# Altium schematic sheet 1_P1.schdoc
size 391 x 645 mm; Symbol: Drawing-Symbol_A4; Device: Drawing-Symbol_A4; @Project Name: Ai-Camera; @Page Count: 1; @Update Date: 2025-11-25; @Create Date: 2025-08-22; @Schematic Name: Schematic1; @Page No: 1; @Page Name: P1; Company: EasyEDA.com; Version: V1.0; Page Size: A4; @Create Time: 04:24:12; @Update Time: 13:54:11; Width: 1500; Height: 2500; Region Start: 1; X Region Count: 6; Y Region Count: 4; Blade Width: 10; Title Block Position: 3; @Board Name: Board1
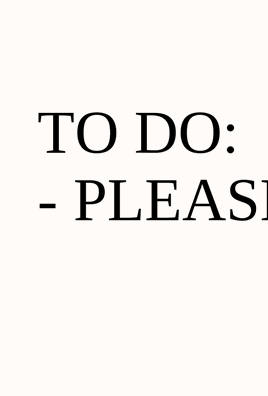
[diagram p0: 1_P1.schdoc, top left]
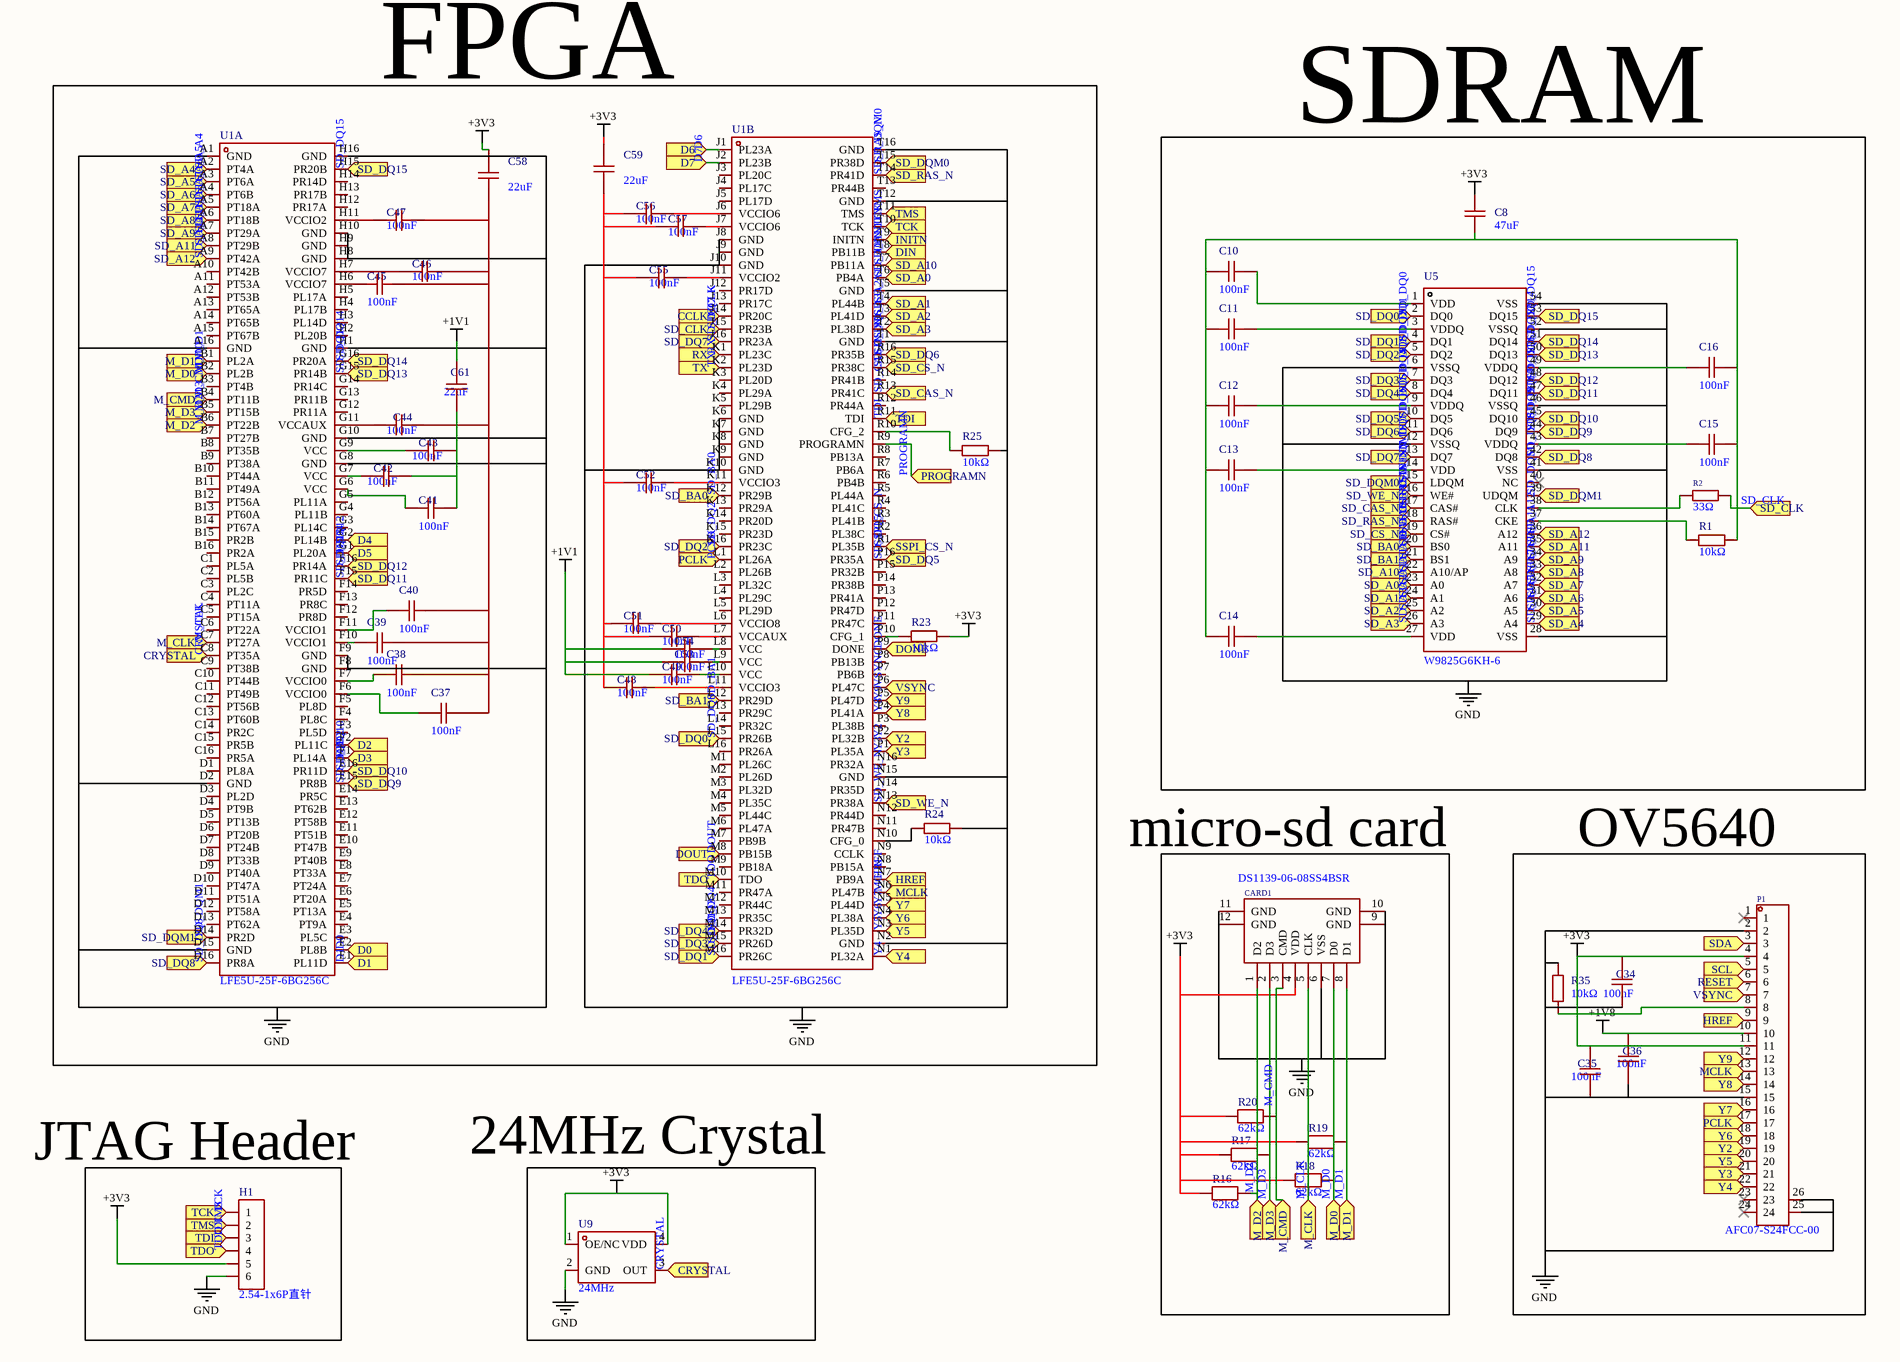
[diagram p1: 1_P1.schdoc, top right]
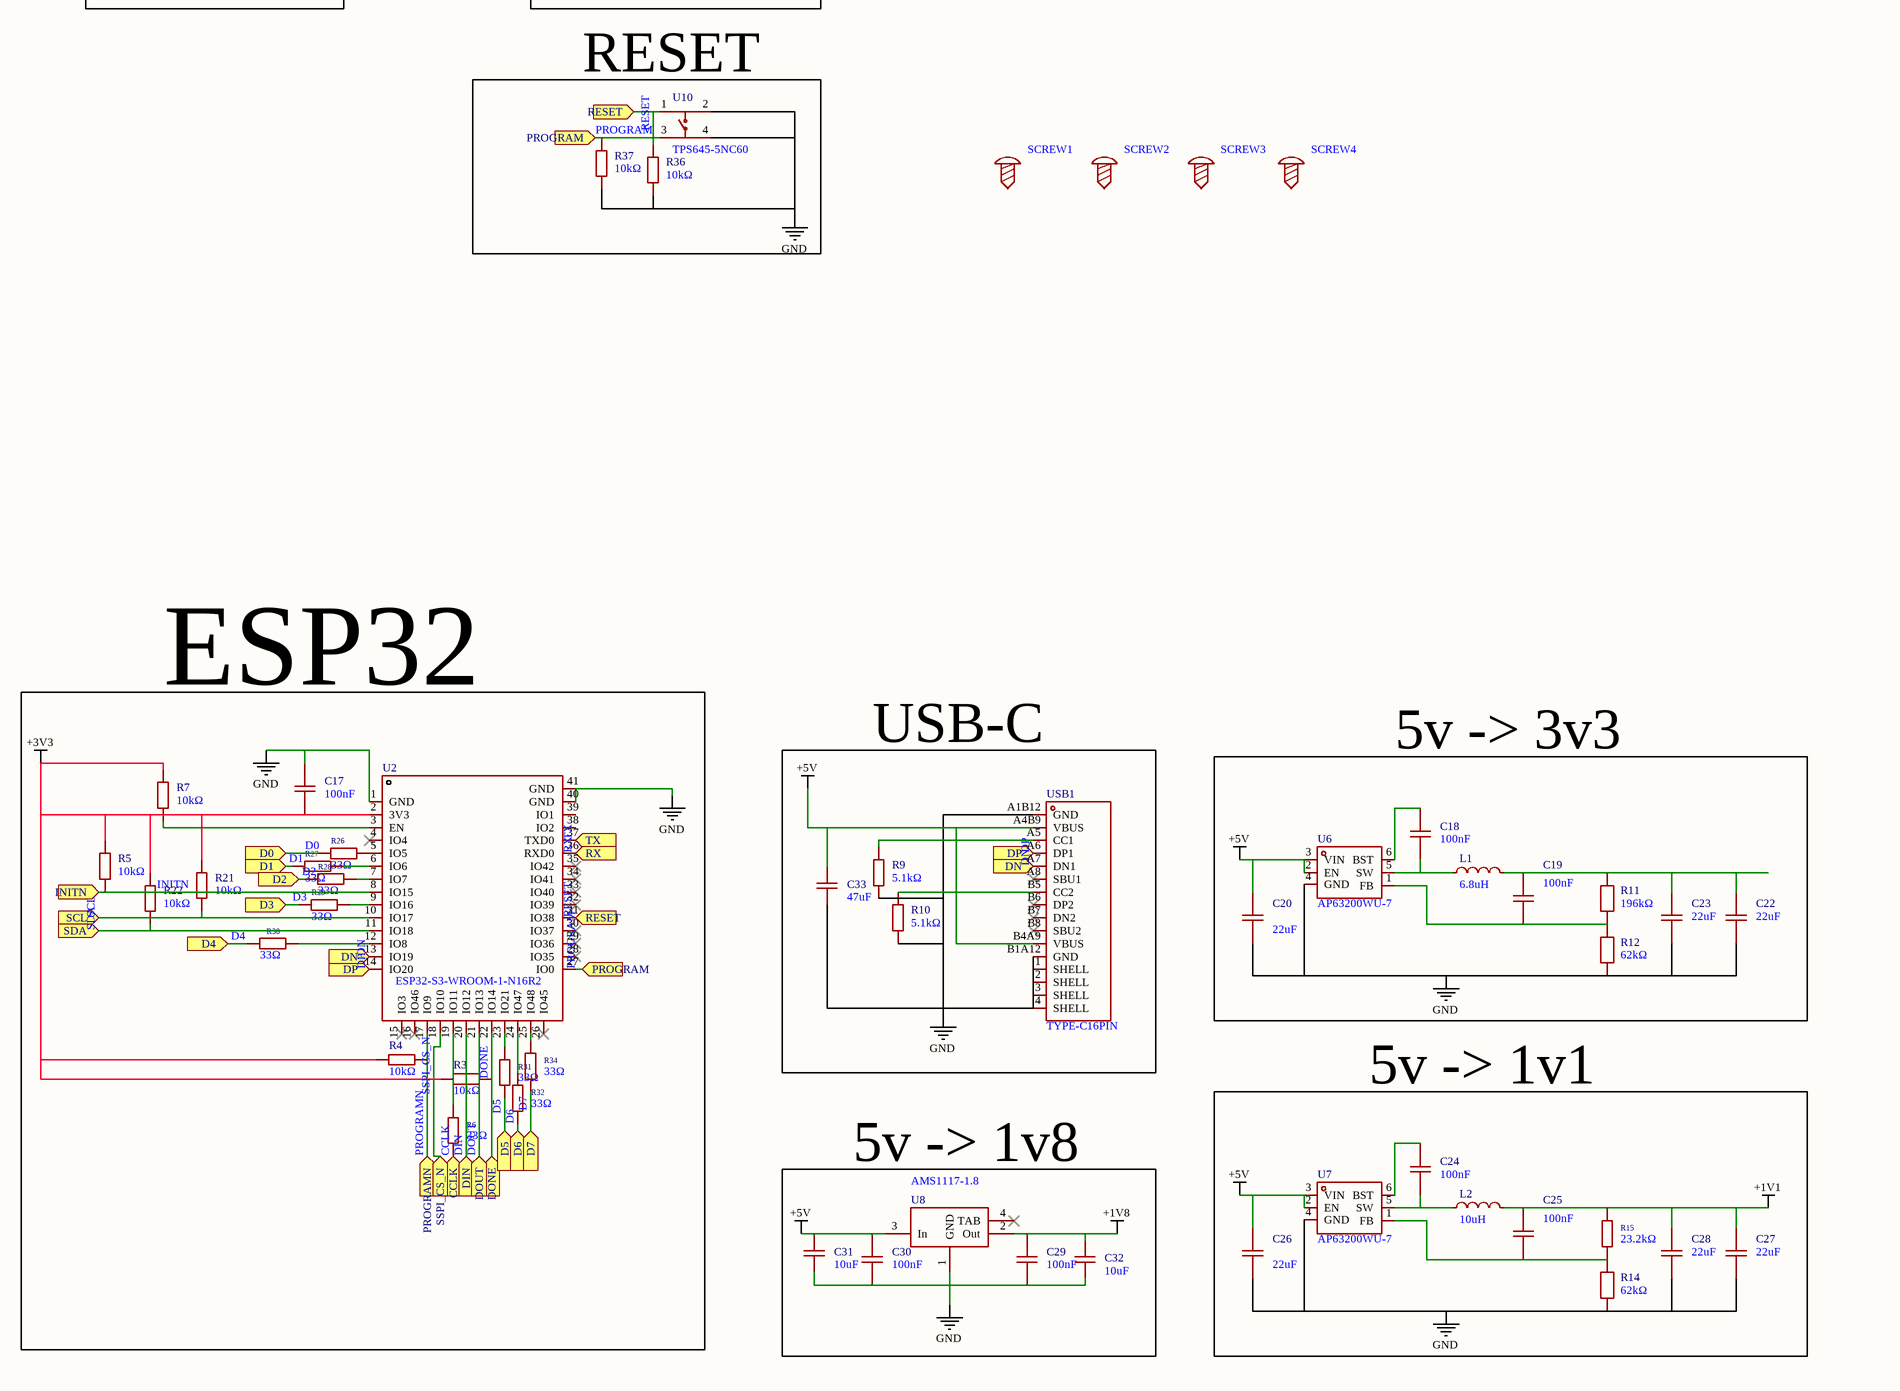
[diagram p2: 1_P1.schdoc, bottom right]

## Parts
C8  47uF  [C0805]
C10  100nF  [C01005]
C11  100nF  [C01005]
C12  100nF  [C01005]
C13  100nF  [C01005]
C14  100nF  [C01005]
C15  100nF  [C01005]
C16  100nF  [C01005]
C17  100nF  [C01005]
C18  100nF  [C01005]
C19  100nF  [C0603]
C20  22uF  [C0603]
C22  22uF  [C0603]
C23  22uF  [C0603]
C24  100nF  [C01005]
C25  100nF  [C0603]
C26  22uF  [C0603]
C27  22uF  [C0603]
C28  22uF  [C0603]
C29  100nF  [C01005]
C30  100nF  [C01005]
C31  10uF  [C0402]
C32  10uF  [C0402]
C33  47uF  [C0805]
C34  100nF  [C01005]
C35  100nF  [C01005]
C36  100nF  [C01005]
C37  100nF  [C01005]
C38  100nF  [C01005]
C39  100nF  [C01005]
C40  100nF  [C01005]
C41  100nF  [C01005]
C42  100nF  [C01005]
C43  100nF  [C01005]
C44  100nF  [C01005]
C45  100nF  [C01005]
C46  100nF  [C01005]
C47  100nF  [C01005]
C48  100nF  [C01005]
C49  100nF  [C01005]
C50  100nF  [C01005]
C51  100nF  [C01005]
C52  100nF  [C01005]
C53  100nF  [C01005]
C54  100nF  [C01005]
C55  100nF  [C01005]
C56  100nF  [C01005]
C57  100nF  [C01005]
C58  22uF  [C0603]
C59  22uF  [C0603]
C61  22uF  [C0603]
CARD1  DS1139-06-08SS4BSR  [TF-SMD_DS1139-06-08SS4BSR]
H1  2.54-1x6P直针  [HDR-TH_6P-P2.54-V-M-1]
L1  6.8uH  [IND-SMD_L7.0-W6.6]
L2  10uH  [IND-SMD_L7.3-W6.8]
P1  AFC07-S24FCC-00  [FPC-SMD_AFC07-S24FCC-00]
R1  10kΩ  [R0402]
R2  33Ω  [R0402]
R3  10kΩ  [R0402]
R4  10kΩ  [R0402]
R5  10kΩ  [R0402]
R6  33Ω  [R0402]
R7  10kΩ  [R0402]
R9  5.1kΩ  [R0603]
R10  5.1kΩ  [R0603]
R11  196kΩ  [R0603]
R12  62kΩ  [R0603]
R14  62kΩ  [R0603]
R15  23.2kΩ  [R0603]
R16  62kΩ  [R0603]
R17  62kΩ  [R0603]
R18  62kΩ  [R0603]
R19  62kΩ  [R0603]
R20  62kΩ  [R0603]
R21  10kΩ  [R0402]
R22  10kΩ  [R0402]
R23  10kΩ  [R0402]
R24  10kΩ  [R0402]
R25  10kΩ  [R0402]
R26  33Ω  [R0402]
R27  33Ω  [R0402]
R28  33Ω  [R0402]
R29  33Ω  [R0402]
R30  33Ω  [R0402]
R31  33Ω  [R0402]
R32  33Ω  [R0402]
R34  33Ω  [R0402]
R35  10kΩ  [R0402]
R36  10kΩ  [R0402]
R37  10kΩ  [R0402]
SCREW1  (no value)  [Screw-Hole-M2]
SCREW2  (no value)  [Screw-Hole-M2]
SCREW3  (no value)  [Screw-Hole-M2]
SCREW4  (no value)  [Screw-Hole-M2]
U1  LFE5U-25F-6BG256C  [CABGA-256_L14.0-W14.0-R16-C16-P0.80-TL]  (parts A,B of 2)
U2  ESP32-S3-WROOM-1-N16R2  [WIRELM-SMD_ESP32-S3-WROOM-1]
U5  W9825G6KH-6  [TSOP-54_L22.2-W10.2-P0.80-LS11.8-BL]
U6  AP63200WU-7  [SOT-23-6_L2.9-W1.6-P0.95-LS2.8-BR]
U7  AP63200WU-7  [SOT-23-6_L2.9-W1.6-P0.95-LS2.8-BR]
U8  AMS1117-1.8  [SOT-223-4_L6.5-W3.5-P2.30-LS7.0-BR]
U9  24MHz  [OSC-SMD_4P-L3.2-W2.5-BL]
U10  TPS645-5NC60  [SW-SMD_4P-L6.0-W6.0-P4.50-LS9.2]
USB1  TYPE-C16PIN  [USB-C-SMD_TYPE-C16PIN]

## Blocks framed on the sheet
FPGA: C37-C59 C61 R23-R25 U1
SDRAM: C8 C10-C16 R1 R2 U5
OV5640: C34-C36 P1 R35
RESET: R36 R37 U10
ESP32: C17 R3-R7 R21 R22 R26-R32 R34 U2
USB-C: C33 R9 R10 USB1
5v -> 3v3: C18-C20 C22 C23 L1 R11 R12 U6
5v -> 1v1: C24-C28 L2 R14 R15 U7
5v -> 1v8: C29-C32 U8

## Ports
CCLK (in), CRYSTAL (in), D0 (in), D1 (in), D2 (in), D3 (in), D4 (in), D5 (in), D6 (in), D7 (in), DIN (in), DN (in), DONE (in), DOUT (in), DP (in), HREF (in), INITN (in), M_CLK (in), M_CMD (in), M_D0 (in), M_D1 (in), M_D2 (in), M_D3 (in), MCLK (in), PCLK (in), PROGRAM (in), PROGRAMN (in), RESET (in), RX (in), SCL (in), SD_A0 (in), SD_A1 (in), SD_A2 (in), SD_A3 (in), SD_A4 (in), SD_A5 (in), SD_A6 (in), SD_A7 (in), SD_A8 (in), SD_A9 (in), SD_A10 (in), SD_A11 (in), SD_A12 (in), SD_BA0 (in), SD_BA1 (in), SD_CAS_N (in), SD_CLK (in), SD_CS_N (in), SD_DQ0 (in), SD_DQ1 (in), SD_DQ2 (in), SD_DQ3 (in), SD_DQ4 (in), SD_DQ5 (in), SD_DQ6 (in), SD_DQ7 (in), SD_DQ8 (in), SD_DQ9 (in), SD_DQ10 (in), SD_DQ11 (in), SD_DQ12 (in), SD_DQ13 (in), SD_DQ14 (in), SD_DQ15 (in), SD_DQM0 (in), SD_DQM1 (in), SD_RAS_N (in), SD_WE_N (in), SDA (in), SSPI_CS_N (in), TCK (in), TDI (in), TDO (in), TMS (in), TX (in), VSYNC (in), Y2 (in), Y3 (in), Y4 (in), Y5 (in), Y6 (in), Y7 (in), Y8 (in), Y9 (in)

## Nets
+1V1: C25.2 C27.2 C28.2 C49.2 C53.2 C54.2 C61.2 L2.2 R15.2
+1V8: C29.1 C32.2 C36.1 P1.10 U8.2(Out)
+3V3: C8.2 C17.2 C34.1 C35.1 C58.2 C59.2 CARD1.4(VDD) H1.5 P1.4 P1.11 R3.1 R4.1 R5.2 R7.2 R16.2 R17.2 R18.2 R19.2 R20.2 R21.2 R22.2 R23.1 U2.2(3V3) U9.1(OE/NC) U9.4(VDD)
+5V: C20.2 C26.2 C30.1 C31.2 C33.2 U6.2(EN) U6.3(VIN) U7.2(EN) U7.3(VIN) U8.3(In) USB1.A4B9(VBUS) USB1.B4A9(VBUS)
GND: C17.1 C20.1 C22.1 C23.1 C26.1 C27.1 C28.1 C33.1 C34.2 C35.2 C36.2 CARD1.6(VSS) CARD1.9(GND) CARD1.10(GND) CARD1.11(GND) CARD1.12(GND) H1.6 P1.2 P1.15 P1.25 P1.26 R9.1 R10.1 R12.1 R14.1 R24.1 R25.1 R35.2 R36.2 R37.2 U1.A1(GND) U1.A16(GND) U1.D2(GND) U1.D15(GND) U1.F8(GND) U1.F9(GND) U1.G8(GND) U1.G10(GND) U1.H1(GND) U1.H8(GND) U1.H9(GND) U1.H10(GND) U1.H16(GND) U1.J8(GND) U1.J9(GND) U1.J10(GND) U1.K6(GND) U1.K7(GND) U1.K8(GND) U1.K9(GND) U1.K10(GND) U1.N2(GND) U1.N15(GND) U1.T1(GND) U1.T5(GND) U1.T12(GND) U1.T16(GND) U2.1(GND) U2.40(GND) U2.41(GND) U5.6(VSSQ) U5.12(VSSQ) U5.28(VSS) U5.41(VSS) U5.46(VSSQ) U5.52(VSSQ) U5.54(VSS) U6.4(GND) U7.4(GND) U8.1(GND) U9.2(GND) U10.2 U10.4 USB1.1(SHELL) USB1.2(SHELL) USB1.3(SHELL) USB1.4(SHELL) USB1.A1B12(GND) USB1.B1A12(GND)
CCLK: R6.1 U1.J14(PR20C) ; port CCLK
CRYSTAL: U1.C8(PT35A) U9.3(OUT) ; port CRYSTAL
D0: R26.1 U1.E2(PL8B) ; port D0
D1: R27.1 U1.E1(PL11D) ; port D1
D2: R28.1 U1.F2(PL11C) ; port D2
D3: R29.1 U1.F1(PL14A) ; port D3
D4: R30.1 U1.G2(PL14B) ; port D4
D5: R31.1 U1.G1(PL20A) ; port D5
D6: R32.1 U1.J1(PL23A) ; port D6
D7: R34.1 U1.J2(PL23B) ; port D7
DIN: U1.T8(PB11B) U2.20(IO12) ; port DIN
DN: U2.13(IO19) USB1.A7(DN1) ; port DN
DONE: R3.2 U1.P9(DONE) U2.22(IO14) ; port DONE
DOUT: U1.M8(PB15B) U2.21(IO13) ; port DOUT
DP: U2.14(IO20) USB1.A6(DP1) ; port DP
HREF: P1.9 U1.N7(PB9A) ; port HREF
INITN: R5.1 U1.T9(INITN) U2.8(IO15) ; port INITN
M_CLK: CARD1.5(CLK) U1.C7(PT27A) ; port M_CLK
M_CMD: CARD1.3(CMD) R20.1 U1.B4(PT11B) ; port M_CMD
M_D0: CARD1.7(D0) R18.1 U1.B2(PL2B) ; port M_D0
M_D1: CARD1.8(D1) R19.1 U1.B1(PL2A) ; port M_D1
M_D2: CARD1.1(D2) R16.1 U1.B6(PT22B) ; port M_D2
M_D3: CARD1.2(D3) R17.1 U1.B5(PT15B) ; port M_D3
MCLK: P1.13 U1.N6(PL47B) ; port MCLK
PCLK: P1.17 U1.L1(PL26A) ; port PCLK
PROGRAM: R37.1 U2.27(IO0) U10.3 ; port PROGRAM
PROGRAMN: R4.2 U1.R9(PROGRAMN) U2.17(IO9) ; port PROGRAMN
RESET: P1.6 R36.1 U2.31(IO38) U10.1 ; port RESET
RX: U1.K1(PL23C) U2.36(RXD0) ; port RX
SCL: P1.5 R21.1 U2.10(IO17) ; port SCL
SD_A0: U1.T6(PB4A) U5.23(A0) ; port SD_A0
SD_A1: U1.T4(PL44B) U5.24(A1) ; port SD_A1
SD_A2: U1.T3(PL41D) U5.25(A2) ; port SD_A2
SD_A3: U1.T2(PL38D) U5.26(A3) ; port SD_A3
SD_A4: U1.A2(PT4A) U5.29(A4) ; port SD_A4
SD_A5: U1.A3(PT6A) U5.30(A5) ; port SD_A5
SD_A6: U1.A4(PT6B) U5.31(A6) ; port SD_A6
SD_A7: U1.A5(PT18A) U5.32(A7) ; port SD_A7
SD_A8: U1.A6(PT18B) U5.33(A8) ; port SD_A8
SD_A9: U1.A7(PT29A) U5.34(A9) ; port SD_A9
SD_A10: U1.T7(PB11A) U5.22(A10/AP) ; port SD_A10
SD_A11: U1.A8(PT29B) U5.35(A11) ; port SD_A11
SD_A12: U1.A9(PT42A) U5.36(A12) ; port SD_A12
SD_BA0: U1.K12(PR29B) U5.20(BS0) ; port SD_BA0
SD_BA1: U1.L12(PR29D) U5.21(BS1) ; port SD_BA1
SD_CAS_N: U1.R13(PR41C) U5.17(CAS#) ; port SD_CAS_N
SD_CLK: R2.2 U1.J15(PR23B) ; port SD_CLK
SD_CS_N: U1.R15(PR38C) U5.19(CS#) ; port SD_CS_N
SD_DQ0: U1.L15(PR26B) U5.2(DQ0) ; port SD_DQ0
SD_DQ1: U1.M16(PR26C) U5.4(DQ1) ; port SD_DQ1
SD_DQ2: U1.K16(PR23C) U5.5(DQ2) ; port SD_DQ2
SD_DQ3: U1.M15(PR26D) U5.7(DQ3) ; port SD_DQ3
SD_DQ4: U1.M14(PR32D) U5.8(DQ4) ; port SD_DQ4
SD_DQ5: U1.P16(PR35A) U5.10(DQ5) ; port SD_DQ5
SD_DQ6: U1.R16(PR35B) U5.11(DQ6) ; port SD_DQ6
SD_DQ7: U1.J16(PR23A) U5.13(DQ7) ; port SD_DQ7
SD_DQ8: U1.D16(PR8A) U5.42(DQ8) ; port SD_DQ8
SD_DQ9: U1.E15(PR8B) U5.44(DQ9) ; port SD_DQ9
SD_DQ10: U1.E16(PR11D) U5.45(DQ10) ; port SD_DQ10
SD_DQ11: U1.F15(PR11C) U5.47(DQ11) ; port SD_DQ11
SD_DQ12: U1.F16(PR14A) U5.48(DQ12) ; port SD_DQ12
SD_DQ13: U1.G15(PR14B) U5.50(DQ13) ; port SD_DQ13
SD_DQ14: U1.G16(PR20A) U5.51(DQ14) ; port SD_DQ14
SD_DQ15: U1.H15(PR20B) U5.53(DQ15) ; port SD_DQ15
SD_DQM0: U1.T15(PR38D) U5.15(LDQM) ; port SD_DQM0
SD_DQM1: U1.D14(PR2D) U5.39(UDQM) ; port SD_DQM1
SD_RAS_N: U1.T14(PR41D) U5.18(RAS#) ; port SD_RAS_N
SD_WE_N: U1.N13(PR38A) U5.16(WE#) ; port SD_WE_N
SDA: P1.3 R22.1 U2.11(IO18) ; port SDA
SSPI_CS_N: U1.R1(PL35B) U2.18(IO10) ; port SSPI_CS_N
TCK: H1.1 U1.T10(TCK) ; port TCK
TDI: H1.3 U1.R11(TDI) ; port TDI
TDO: H1.4 U1.M10(TDO) ; port TDO
TMS: H1.2 U1.T11(TMS) ; port TMS
TX: U1.K2(PL23D) U2.37(TXD0) ; port TX
VSYNC: P1.7 U1.P6(PL47C) ; port VSYNC
Y2: P1.19 U1.P2(PL32B) ; port Y2
Y3: P1.21 U1.P1(PL35A) ; port Y3
Y4: P1.22 U1.N1(PL32A) ; port Y4
Y5: P1.20 U1.N3(PL35D) ; port Y5
Y6: P1.18 U1.N4(PL38A) ; port Y6
Y7: P1.16 U1.N5(PL44D) ; port Y7
Y8: P1.14 U1.P4(PL41A) ; port Y8
Y9: P1.12 U1.P5(PL47D) ; port Y9
NetC8_1: C8.1 C10.2 C11.2 C12.2 C13.2 C14.2 C15.1 C16.1 R1.2
NetC10_1: C10.1 U5.1(VDD)
NetC11_1: C11.1 U5.3(VDDQ)
NetC12_1: C12.1 U5.9(VDDQ)
NetC13_1: C13.1 U5.14(VDD)
NetC14_1: C14.1 U5.27(VDD)
NetC15_2: C15.2 U5.43(VDDQ)
NetC16_2: C16.2 U5.49(VDDQ)
NetC18_1: C18.1 U6.6(BST)
NetC18_2: C18.2 L1.1 U6.5(SW)
NetC19_1: C19.1 R11.1 R12.2 U6.1(FB)
NetC19_2: C19.2 C22.2 C23.2 L1.2 R11.2
NetC24_1: C24.1 U7.6(BST)
NetC24_2: C24.2 L2.1 U7.5(SW)
NetC25_1: C25.1 R14.2 R15.1 U7.1(FB)
NetC29_2: C29.2 C30.2 C31.1 C32.1
NetC37_1: C37.1 C38.1 C39.1 C40.1 C44.1 C45.1 C46.1 C47.1 C58.1
NetC37_2: C37.2 U1.F6(VCCIO0)
NetC38_2: C38.2 U1.F7(VCCIO0)
NetC39_2: C39.2 U1.F10(VCCIO1)
NetC40_2: C40.2 U1.F11(VCCIO1)
NetC41_1: C41.1 C42.1 C43.1 C61.1
NetC41_2: C41.2 U1.G6(VCC)
NetC42_2: C42.2 U1.G7(VCC)
NetC43_2: C43.2 U1.G9(VCC)
NetC44_2: C44.2 U1.G11(VCCAUX)
NetC45_2: C45.2 U1.H6(VCCIO7)
NetC46_2: C46.2 U1.H7(VCCIO7)
NetC47_2: C47.2 U1.H11(VCCIO2)
NetC48_1: C48.1 U1.L11(VCCIO3)
NetC48_2: C48.2 C50.2 C51.2 C52.2 C55.2 C56.2 C57.2 C59.1
NetC49_1: C49.1 U1.L10(VCC)
NetC50_1: C50.1 U1.L7(VCCAUX)
NetC51_1: C51.1 U1.L6(VCCIO8)
NetC52_1: C52.1 U1.K11(VCCIO3)
NetC53_1: C53.1 U1.L9(VCC)
NetC54_1: C54.1 U1.L8(VCC)
NetC55_1: C55.1 U1.J11(VCCIO2)
NetC56_1: C56.1 U1.J6(VCCIO6)
NetC57_1: C57.1 U1.J7(VCCIO6)
NetP1_8: P1.8 R35.1
NetR1_1: R1.1 U5.37(CKE)
NetR2_1: R2.1 U5.38(CLK)
NetR6_2: R6.2 U2.19(IO11)
NetR7_1: R7.1 U2.3(EN)
NetR9_2: R9.2 USB1.A5(CC1)
NetR10_2: R10.2 USB1.B5(CC2)
NetR23_2: R23.2 U1.P10(CFG_1)
NetR24_2: R24.2 U1.N10(CFG_0)
NetR25_2: R25.2 U1.R10(CFG_2)
NetR26_2: R26.2 U2.5(IO5)
NetR27_2: R27.2 U2.6(IO6)
NetR28_2: R28.2 U2.7(IO7)
NetR29_2: R29.2 U2.9(IO16)
NetR30_2: R30.2 U2.12(IO8)
NetR31_2: R31.2 U2.23(IO21)
NetR32_2: R32.2 U2.24(IO47)
NetR34_2: R34.2 U2.25(IO48)

Not connected (* = marked no-connect by the designer): P1 1* 23* 24*; SCREW1 1; SCREW2 1; SCREW3 1; SCREW4 1; U1 A10(PT42B) A11(PT53A) A12(PT53B) A13(PT65A) A14(PT65B) A15(PT67B) B3(PT4B) B7(PT27B) B8(PT35B) B9(PT38A) B10(PT44A) B11(PT49A) B12(PT56A) B13(PT60A) B14(PT67A) B15(PR2B) B16(PR2A) C1(PL5A) C2(PL5B) C3(PL2C) C4(PT11A) C5(PT15A) C6(PT22A) C9(PT38B) C10(PT44B) C11(PT49B) C12(PT56B) C13(PT60B) C14(PR2C) C15(PR5B) C16(PR5A) D1(PL8A) D3(PL2D) D4(PT9B) D5(PT13B) D6(PT20B) D7(PT24B) D8(PT33B) D9(PT40A) D10(PT47A) D11(PT51A) D12(PT58A) D13(PT62A) E3(PL5C) E4(PT9A) E5(PT13A) E6(PT20A) E7(PT24A) E8(PT33A) E9(PT40B) E10(PT47B) E11(PT51B) E12(PT58B) E13(PT62B) E14(PR5C) F3(PL5D) F4(PL8C) F5(PL8D) F12(PR8D) F13(PR8C) F14(PR5D) G3(PL14C) G4(PL11B) G5(PL11A) G12(PR11A) G13(PR11B) G14(PR14C) H2(PL20B) H3(PL14D) H4(PL17B) H5(PL17A) H12(PR17A) H13(PR17B) H14(PR14D) J3(PL20C) J4(PL17C) J5(PL17D) J12(PR17D) J13(PR17C) K3(PL20D) K4(PL29A) K5(PL29B) K13(PR29A) K14(PR20D) K15(PR23D) L2(PL26B) L3(PL32C) L4(PL29C) L5(PL29D) L13(PR29C) L14(PR32C) L16(PR26A) M1(PL26C) M2(PL26D) M3(PL32D) M4(PL35C) M5(PL44C) M6(PL47A) M7(PB9B) M9(PB18A) M11(PR47A) M12(PR44C) M13(PR35C) N8(PB15A) N9(CCLK) N11(PR47B) N12(PR44D) N14(PR35D) N16(PR32A) P3(PL38B) P7(PB6B) P8(PB13B) P11(PR47C) P12(PR47D) P13(PR41A) P14(PR38B) P15(PR32B) R2(PL38C) R3(PL41B) R4(PL41C) R5(PL44A) R6(PB4B) R7(PB6A) R8(PB13A) R12(PR44A) R14(PR41B) T13(PR44B); U2 4(IO4)* 15(IO3)* 16(IO46)* 26(IO45)* 28(IO35)* 29(IO36)* 30(IO37)* 32(IO39)* 33(IO40)* 34(IO41)* 35(IO42)* 38(IO2) 39(IO1); U5 40(NC)*; U8 4(TAB)*; USB1 A8(SBU1)* B6(DP2)* B7(DN2)* B8(SBU2)*

## Notes on the sheet
- TO DO:
  - PLEASE CHECK THE POWER ON FPGA
- micro-sd card
- (near H1) JTAG Header
- 24MHz Crystal
- 1
- 2
- 3
- 4
- 5
- 6
- A
- B
- C
- D
- Schematic
- Schematic1
- Create at
- Update at
- 2025-08-22
- 2025-11-25
- Board
- Drawn
- Board1
- Page
- P1
- Reviewed
- Version
- Size
- Ai-Camera
- Page  1  Total  1
- V1.0
- A4
- EasyEDA.com

## Library data of the parts
C8 C33 = CL21A476MQYNNNE: Manufacturer: SAMSUNG(三星); Add into BOM: yes; Tolerance: ±20%; Voltage Rating: 6.3V; Temperature Coefficient: X5R; Symbol: CL21A476MQYNNNE; Device: CL21A476MQYNNNE; LCSC Part Name: 47uF ±20% 6.3V; Supplier Part: C16780; Manufacturer Part: CL21A476MQYNNNE; Supplier Footprint: 0805; JLCPCB Part Class: Basic Part; Datasheet: https://item.szlcsc.com/datasheet/CL21A476MQYNNNE/17464.html; Supplier: LCSC; Convert to PCB: yes; Value: 47uF
C10-C18 C24 C29 C30 C34-C57 = GRM022R60J104KE15D: Manufacturer: muRata(村田); Add into BOM: yes; Tolerance: ±10%; Voltage Rating: 6.3V; Temperature Coefficient: X5R; Symbol: GRM022R60J104KE15D; Device: GRM022R60J104KE15D; LCSC Part Name: 100nF ±10% 6.3V; Supplier Part: C161362; Manufacturer Part: GRM022R60J104KE15D; Supplier Footprint: 01005; JLCPCB Part Class: Extended Part; Datasheet: https://atta.szlcsc.com/upload/public/pdf/source/20200305/C490387_23319AE8C154DEB24C505E6C82A8106A.pdf; Supplier: LCSC; Convert to PCB: yes; Value: 100nF
C19 C25 = TCC0603X7R104K500CT: Manufacturer: CCTC(三环); Add into BOM: yes; Tolerance: ±10%; Voltage Rating: 50V; Temperature Coefficient: X7R; Symbol: TCC0603X7R104K500CT; Device: TCC0603X7R104K500CT; LCSC Part Name: 100nF ±10% 50V; Supplier Part: C282519; Manufacturer Part: TCC0603X7R104K500CT; Supplier Footprint: 0603; JLCPCB Part Class: Extended Part; Datasheet: https://item.szlcsc.com/datasheet/TCC0603X7R104K500CT/268639.html; Supplier: LCSC; Convert to PCB: yes; Value: 100nF
C20 C22 C23 C26-C28 C58 C59 C61 = TCC0603X5R226M6R3CT: Manufacturer: CCTC(三环); Add into BOM: yes; Tolerance: ±20%; Voltage Rating: 6.3V; Temperature Coefficient: X5R; Symbol: TCC0603X5R226M6R3CT; Device: TCC0603X5R226M6R3CT; LCSC Part Name: 22uF ±20% 6.3V; Supplier Part: C380323; Manufacturer Part: TCC0603X5R226M6R3CT; Supplier Footprint: 0603; JLCPCB Part Class: Extended Part; Datasheet: https://item.szlcsc.com/datasheet/TCC0603X5R226M6R3CT/352728.html; Supplier: LCSC; Convert to PCB: yes; Value: 22uF
C31 C32 = GRM155R60J106ME44D: Manufacturer: muRata(村田); Add into BOM: yes; Tolerance: ±20%; Voltage Rating: 6.3V; Temperature Coefficient: X5R; Symbol: GRM155R60J106ME44D; Device: GRM155R60J106ME44D; LCSC Part Name: 10uF ±20% 6.3V; Supplier Part: C76991; Manufacturer Part: GRM155R60J106ME44D; Supplier Footprint: 0402; JLCPCB Part Class: Extended Part; Datasheet: https://item.szlcsc.com/datasheet/GRM155R60J106ME44D/78118.html; Supplier: LCSC; Convert to PCB: yes; Value: 10uF
CARD1 = DS1139-06-08SS4BSR: Manufacturer: CONNFLY; Add into BOM: yes; Card Connection Mode: Hinged Lid; Card Type: MicroSD Card (TF Card); Connector Type: Connector and Ejector; Symbol: DS1139-06-08SS4BSR; Device: DS1139-06-08SS4BSR; Supplier: LCSC; Manufacturer Part: DS1139-06-08SS4BSR; Supplier Part: C86574; JLCPCB Part Class: Extended Part; LCSC Part Name: 翻盖式 MicroSD卡(TF卡) 卡座; Supplier Footprint: SMD; Datasheet: https://item.szlcsc.com/datasheet/DS1139-06-08SS4BSR/87751.html; Convert to PCB: yes; Height Above Board: -; Operating Temperature: -
H1 = 2.54-1x6P直针: Manufacturer: BOOMELE(博穆精密); Symbol: Header-Male-2.54_1x6; Add into BOM: yes; Pin Structure: 1x6P; Pitch: 2.54mm; Circluar Pins/Square Pins: Pin Header; Current Rating: 3A; Device: 2.54-1x6P直针; LCSC Part Name: 1x6P 间距:2.54mm 方针 直插; Supplier Part: C37208; Manufacturer Part: 2.54-1x6P直针; Supplier Footprint: 插件,P=2.54mm; JLCPCB Part Class: Extended Part; Datasheet: https://item.szlcsc.com/datasheet/2.54-1x6P%25E7%259B%25B4%25E9%2592%2588/38187.html; Supplier: LCSC; Convert to PCB: yes; Row Spacing: -; Mounting Type: Through Hole; Number of Rows: 1; Number of Pins: 6P; Voltage Rating (Max): -; Length of Mating Pin: 6mm; Insulation Height: 2.5mm; Length of End Connection Pin: 3mm; Contact Material: Brass; Contact Plating: Gold; Operating Temperature: -40℃~+105℃; Color: Black
L1 = FXL0630-6R8-M: Manufacturer: cjiang(长江微电); Add into BOM: yes; Tolerance: ±20%; Current Rating: 5A; Current - Saturation(Isat): 6A; DC Resistance(DCR): 48mΩ; Type: Molded Inductor; Symbol: FXL0630-6R8-M; Device: FXL0630-6R8-M; LCSC Part Name: 6.8uH ±20% 6A; Supplier Part: C167221; Manufacturer Part: FXL0630-6R8-M; Supplier Footprint: SMD,7x6.6mm; JLCPCB Part Class: Extended Part; Datasheet: https://item.szlcsc.com/datasheet/FXL0630-6R8-M/178604.html; Supplier: LCSC; Convert to PCB: yes; Value: 6.8uH
L2 = FXL0630-100-M: Manufacturer: cjiang(长江微电); Add into BOM: yes; Tolerance: ±20%; Saturation Current (Isat): 5.5A; Type: Integrated molded inductor; Symbol: FXL0630-100-M; Device: FXL0630-100-M; LCSC Part Name: 10uH ±20% 5.5A; Supplier Part: C167223; Manufacturer Part: FXL0630-100-M; Supplier Footprint: SMD,6.6x7mm; JLCPCB Part Class: Extended Part; Datasheet: https://atta.szlcsc.com/upload/public/pdf/source/20240426/3189EA8206330E2108542F9E34E540E7.pdf; Supplier: LCSC; Convert to PCB: yes; Value: 10uH; Ratings: -
P1 = AFC07-S24FCC-00: Manufacturer: JS(钜硕电子); Symbol: FPC 0.5MM 24P Pull type H2.0mm Under the next; Add into BOM: yes; Locking Feature: Slide Lock; Number of Contacts: 24P; Pitch: 0.5mm; FFC, FCB Thickness: 0.3mm; Device: AFC07-S24FCC-00; Supplier: LCSC; Manufacturer Part: AFC07-S24FCC-00; Supplier Part: C11057; JLCPCB Part Class: Extended Part; LCSC Part Name: 间距:0.5mm P数:24P 抽屉式 下接; Supplier Footprint: SMD,P=0.5mm,卧贴; Datasheet: https://item.szlcsc.com/datasheet/AFC07-S24FCC-00/11604.html; Convert to PCB: yes; Contact Type: Bottom Contact; Mounting Type: Surface Mount, Right Angle; Height Above Board: 2mm
R1 R3-R5 R7 R21-R25 R35-R37 = 0402WGF1002TCE: Manufacturer: UNI-ROYAL(厚声); Add into BOM: yes; Tolerance: ±1%; Power(Watts): 62.5mW; Voltage-Supply(Max): 50V; Temperature Coefficient: ±100ppm/℃; Symbol: 0402WGF1002TCE; Device: 0402WGF1002TCE; LCSC Part Name: 10kΩ ±1% 62.5mW 厚膜电阻; Supplier Part: C25744; Manufacturer Part: 0402WGF1002TCE; Supplier Footprint: 0402; JLCPCB Part Class: Basic Part; Datasheet: https://item.szlcsc.com/datasheet/0402WGF1002TCE/26487.html; Supplier: LCSC; Convert to PCB: yes; Type: Thick Film Resistor; Value: 10kΩ; Operating Temperature: -55℃~+155℃
R2 R6 R26-R32 R34 = 0402WGF330JTCE: Manufacturer: UNI-ROYAL(厚声); Add into BOM: yes; Tolerance: ±1%; Power(Watts): 62.5mW; Voltage-Supply(Max): 50V; Temperature Coefficient: ±100ppm/℃; Symbol: 0402WGF330JTCE; Device: 0402WGF330JTCE; Supplier: LCSC; Manufacturer Part: 0402WGF330JTCE; Supplier Part: C25105; Value: 33Ω; JLCPCB Part Class: Basic Part; LCSC Part Name: 33Ω ±1% 62.5mW 厚膜电阻; Supplier Footprint: 0402; Datasheet: https://item.szlcsc.com/datasheet/0402WGF330JTCE/25848.html; Convert to PCB: yes; Type: Thick Film Resistor; Operating Temperature: -55℃~+155℃
R9 R10 = 0603WAF5101T5E: Manufacturer: UNI-ROYAL(厚声); Add into BOM: yes; Tolerance: ±1%; Power(Watts): 100mW; Voltage-Supply(Max): 75V; Temperature Coefficient: ±100ppm/℃; Symbol: 0603WAF5101T5E; Device: 0603WAF5101T5E; LCSC Part Name: 5.1kΩ ±1% 100mW 厚膜电阻; Supplier Part: C23186; Manufacturer Part: 0603WAF5101T5E; Supplier Footprint: 0603; JLCPCB Part Class: Basic Part; Datasheet: https://item.szlcsc.com/datasheet/0603WAF5101T5E/23913.html; Supplier: LCSC; Convert to PCB: yes; Type: Thick Film Resistor; Value: 5.1kΩ; Operating Temperature: -55℃~+155℃
R11 = FRC0603F1963TS: Manufacturer: FOJAN(富捷); Add into BOM: yes; Tolerance: ±1%; Power(Watts): 100mW; Voltage-Supply(Max): 75V; Temperature Coefficient: ±100ppm/℃; Symbol: FRC0603F1963TS; Device: FRC0603F1963TS; LCSC Part Name: 196kΩ ±1% 100mW 厚膜电阻; Supplier Part: C2974032; Manufacturer Part: FRC0603F1963TS; Supplier Footprint: 0603; JLCPCB Part Class: Extended Part; Supplier: LCSC; Convert to PCB: yes; Type: Thick Film Resistor; Value: 196kΩ; Operating Temperature: -55℃~+155℃
R12 R14 R16-R20 = FRC0603F6202TS: Manufacturer: FOJAN(富捷); Add into BOM: yes; Tolerance: ±1%; Power(Watts): 100mW; Voltage-Supply(Max): 75V; Temperature Coefficient: ±100ppm/℃; Symbol: FRC0603F6202TS; Device: FRC0603F6202TS; LCSC Part Name: 62kΩ ±1% 100mW 厚膜电阻; Supplier Part: C2907059; Manufacturer Part: FRC0603F6202TS; Supplier Footprint: 0603; JLCPCB Part Class: Extended Part; Supplier: LCSC; Convert to PCB: yes; Type: Thick Film Resistor; Value: 62kΩ; Operating Temperature: -55℃~+155℃
R15 = 0603WAF2322T5E: Manufacturer: UNI-ROYAL(厚声); Add into BOM: yes; Tolerance: ±1%; Power(Watts): 100mW; Voltage-Supply(Max): 75V; Temperature Coefficient: ±100ppm/℃; Symbol: 0603WAF2322T5E; Device: 0603WAF2322T5E; Supplier: LCSC; Manufacturer Part: 0603WAF2322T5E; Supplier Part: C23346; Value: 23.2kΩ; JLCPCB Part Class: Extended Part; LCSC Part Name: 23.2kΩ ±1% 100mW 厚膜电阻; Supplier Footprint: 0603; Datasheet: https://item.szlcsc.com/datasheet/0603WAF2322T5E/24079.html; Convert to PCB: yes; Type: Thick Film Resistor; Operating Temperature: -55℃~+155℃
SCREW1-SCREW4 = Screw-Hole-M2: Add into BOM: yes; Symbol: Screw-Hole; Device: Screw-Hole-M2; Convert to PCB: yes; Supplier Footprint: 插件
U1 = LFE5U-25F-6BG256C: Manufacturer: LATTICE(莱迪思); Add into BOM: yes; Logic Elements / Cells: 24000; Logic Array Blocks: 6000; Embedded Block RAM: 1032192bit; Relevance: []; Symbol: LFE5U-25F-6BG256C; Device: LFE5U-25F-6BG256C; LCSC Part Name: LFE5U 25F 6BG256C; Supplier Part: C1521614; Manufacturer Part: LFE5U-25F-6BG256C; Supplier Footprint: CABGA-256; JLCPCB Part Class: Extended Part; Datasheet: https://atta.szlcsc.com/upload/public/pdf/source/20221202/6704A1754335A6F4ED4829569A52AB14.pdf; Supplier: LCSC; Convert to PCB: yes; Type: -; Number of Logic Gates: -; Supply Voltage Range - VCCIO: -; Maximum Delay Time Tpd: -; Operating Temperature Range: 0℃~+85℃
U2 = ESP32-S3-WROOM-1-N16R2: Manufacturer: ESPRESSIF(乐鑫); Symbol: ESP32-S3-WROOM-1(N16R2); Add into BOM: yes; Device: ESP32-S3-WROOM-1-N16R2; LCSC Part Name: 通用型Wi-Fi+低功耗蓝牙MCU模组; Supplier Part: C2913205; Manufacturer Part: ESP32-S3-WROOM-1-N16R2; Supplier Footprint: SMD,25.5x18mm; JLCPCB Part Class: Extended Part; Datasheet: https://item.szlcsc.com/datasheet/ESP32-S3-WROOM-1-N16R2/3198303.html; Supplier: LCSC; Convert to PCB: yes
U5 = W9825G6KH-6: Manufacturer: Winbond(华邦); Add into BOM: yes; Memory Size: 256Mbit; Clock Frequency: 166MHz; Voltage - Supply: 3V~3.6V; Symbol: W9825G6KH-6; Device: W9825G6KH-6; LCSC Part Name: 4M×4存储体×16位SDRAM; Supplier Part: C62246; Manufacturer Part: W9825G6KH-6; Supplier Footprint: TSOP-54-10.2mm; JLCPCB Part Class: Extended Part; Datasheet: https://item.szlcsc.com/datasheet/W9825G6KH-6/63303.html; Supplier: LCSC; Convert to PCB: yes; Operating Temperature: 0℃~+70℃
U6 U7 = AP63200WU-7: Manufacturer: DIODES(美台); Add into BOM: yes; Function: Buck; Voltage - Supply: 3.8V~32V; Output Current: 2A; Frequency - Switching: 500kHz; Number of Outputs: 1; Quiescent Current: 22uA; Switch tube (built-in/external): Built-In; Output Type: Adjustable; Symbol: AP63200WU-7; Device: AP63200WU-7; LCSC Part Name: 3.8V至32V输入、2A低静态电流同步降压转换器，增强EMI抑制; Supplier Part: C2071868; Manufacturer Part: AP63200WU-7; Supplier Footprint: TSOT-23-6; JLCPCB Part Class: Extended Part; Datasheet: https://item.szlcsc.com/datasheet/AP63200WU-7/2163451.html; Supplier: LCSC; Convert to PCB: yes; Output Voltage: -; Operating Temperature: -40℃~+85℃; Synchronous Rectifier: Yes; Topology: Buck
U8 = AMS1117-1.8_C6185: Manufacturer: AMS; Add into BOM: yes; Output Type: Fixed; Voltage - Supply: 15V; Output Voltage: 1.8V; Output Current: 1A; Power Supply Rejection Ratio (PSRR): 72dB@(120Hz); Voltage Dropout: 1.3V@(1A); Noise: 0.003%Vout; Output Configuration: Positive; Number of Outputs: 1; Symbol: AMS1117-1.8; Device: AMS1117-1.8_C6185; LCSC Part Name: 输入15V 输出1.8V 1A; Supplier Part: C6185; Manufacturer Part: AMS1117-1.8; Supplier Footprint: SOT-223; JLCPCB Part Class: Extended Part; Datasheet: https://item.szlcsc.com/datasheet/AMS1117-1.8/6651.html; Supplier: LCSC; Convert to PCB: yes; Operating Temperature: -40℃~+125℃@(Tj)
U9 = XOS32024000LT00351005: Manufacturer: 同晶; Add into BOM: yes; Normal temperature Frequency Tolerance: ±10ppm; Output Type: CMOS; Voltage - Supply: 1.62V~3.63V; Current - Supply: 5mA; Frequency Stability: ±20ppm; Symbol: XOS32024000LT00351005; Device: XOS32024000LT00351005; LCSC Part Name: 24MHz 4P 3225 1.8V-3.3V ±10PPM -40~85℃ (±20PPM) CMOS; Supplier Part: C37635416; Manufacturer Part: XOS32024000LT00351005; Supplier Footprint: SMD3225-4P; JLCPCB Part Class: Extended Part; Datasheet: https://item.szlcsc.com/datasheet/XOS32024000LT00351005/39361348.html; Supplier: LCSC; Convert to PCB: yes; Value: 24MHz; Operating Temperature: -40℃~+85℃
U10 = TPS645-5NC60: Manufacturer: ROCPU Switches(台普); Add into BOM: yes; Symbol: TPS645-5NC60; Device: TPS645-5NC60; LCSC Part Name: 6X6X6H 260克力 贴片轻触开关; Supplier Part: C19191552; Manufacturer Part: TPS645-5NC60; Supplier Footprint: -; JLCPCB Part Class: Extended Part; Datasheet: https://atta.szlcsc.com/upload/public/pdf/source/20231204/193B3ACAB5A471A76A9359FBA22C7A2C.pdf; Supplier: LCSC; Convert to PCB: yes
USB1 = TYPE-C16PIN: Manufacturer: SHOU HAN(首韩); Add into BOM: yes; Connector Type: Type-C; Protocol Standard: USB 3.1; Gender: Female; Number of Contacts: 16P; Number of Ports: 1; Current Rating-Power: 3A; Voltage Rating: 30V; Connect-Disconnect Life: 10,000 Cycles; Detection color: Black; Symbol: TYPE-C16PIN; Device: TYPE-C16PIN; LCSC Part Name: Type-C 母 卧贴; Supplier Part: C393939; Manufacturer Part: TYPE-C16PIN; Supplier Footprint: SMD; JLCPCB Part Class: Extended Part; Datasheet: https://item.szlcsc.com/datasheet/TYPE-C16PIN/372551.html; Supplier: LCSC; Convert to PCB: yes; Mounting Type: Surface Mount, Right Angle; Operating Temperature: -40℃~+85℃